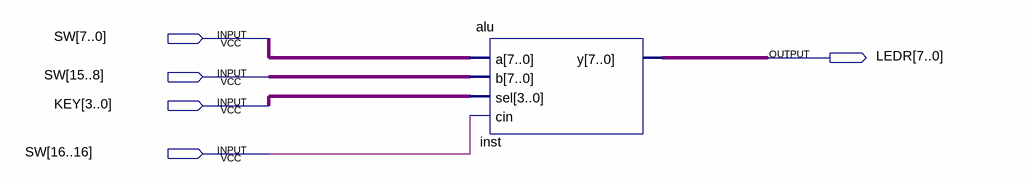
[diagram p0: schematic sheet]
// Quartus schematic alu_1130.bdf as structural Verilog: 1 symbols, 5 pins
module alu_1130 (
  input  [16:0] SW,
  input  [3:0] KEY,
  output [7:0] LEDR
);

  alu inst (.a(SW[7:0]), .b(SW[15:8]), .sel(KEY), .cin(SW[16]), .y(LEDR));
endmodule
